# EasyEDA schematic Schematic.json
TITLE: Pocket Play; REV: 1.0; Date: 2025-04-30; Sheet: 1/1; Drawn By: Nico Brooks; Company: Nico Brooks
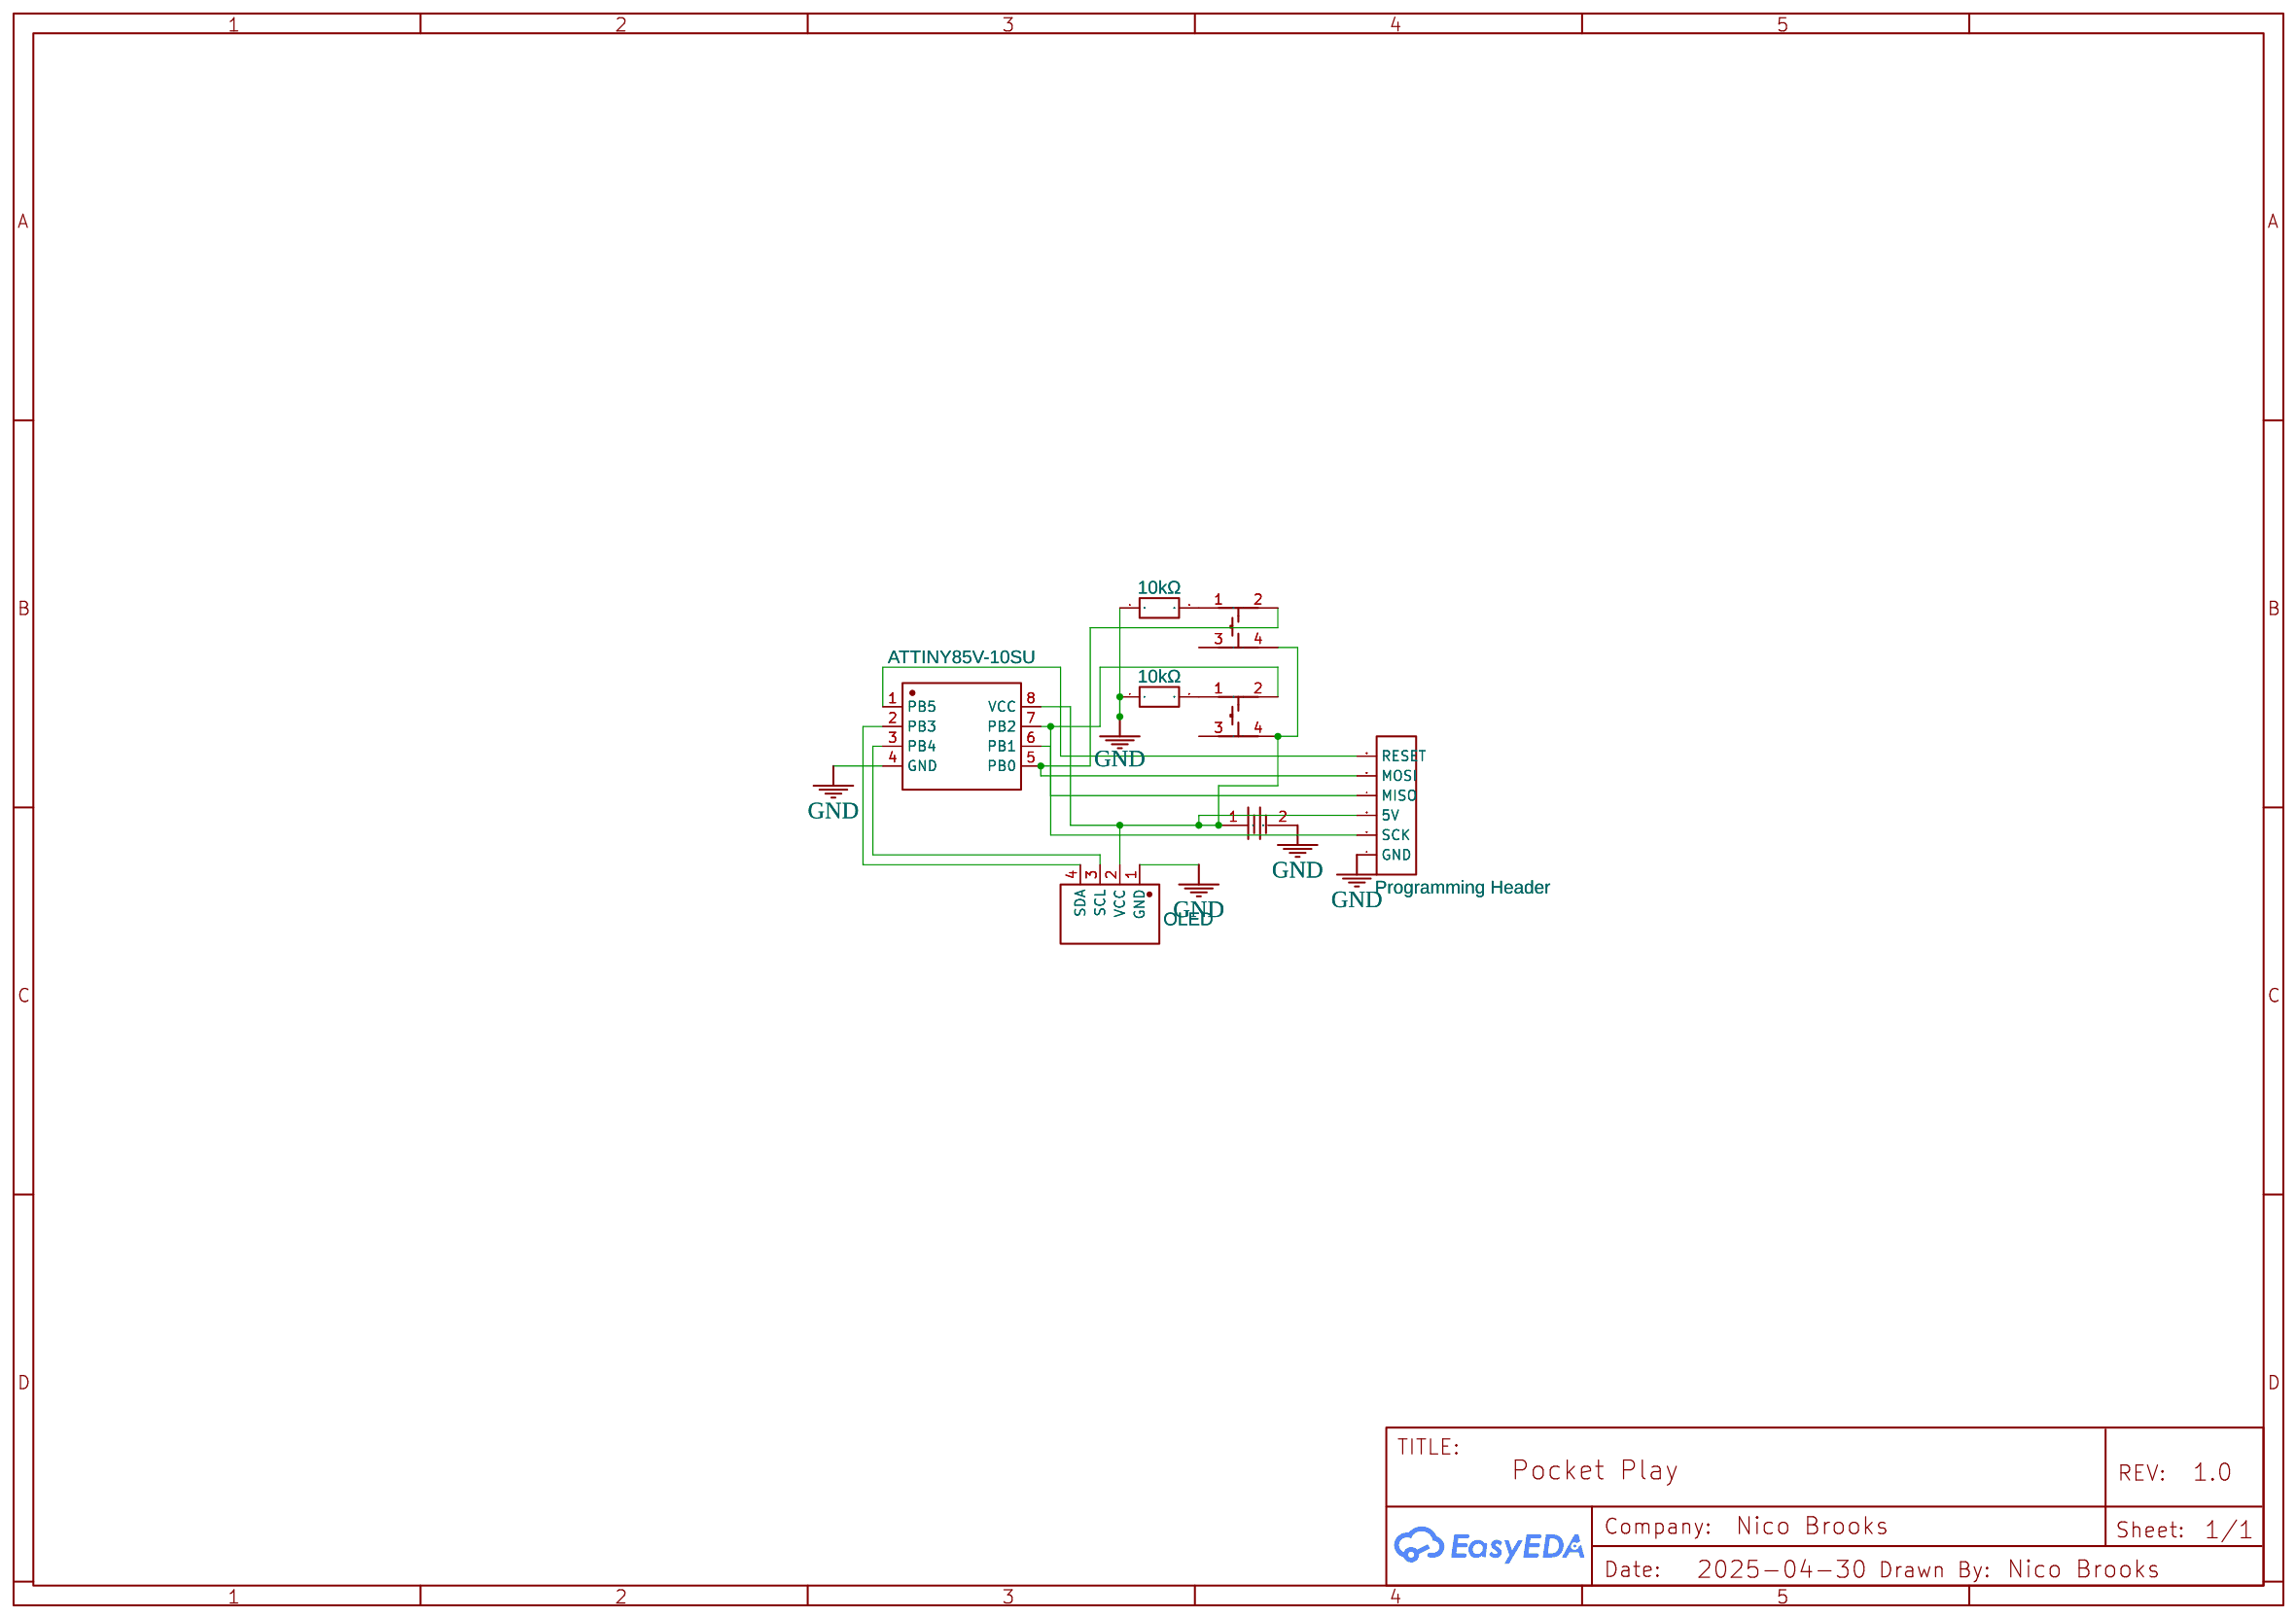
[diagram p0: schematic sheet]

## Parts
B1  CR2032  [BAT-TH_CR2032-BS-6-1]
J1  Programming Header  [HDR-M-2.54_1X6]
OLED1  OLED  [OLED-TH_4P-P2.54-L27.8-W27.3]
U1  10kΩ  [RES-TH_BD2.7-L6.2-P10.20-D0.4]
U2  10kΩ  [RES-TH_BD2.7-L6.2-P10.20-D0.4]
U4  Left Button  [KEY-SMD_4P-L12.0-W12.0-P5.00-LS15.0]
U5  Right Button  [KEY-SMD_4P-L12.0-W12.0-P5.00-LS15.0]
U6  ATTINY85V-10SU  [SOIC-8_L5.3-W5.3-P1.27-LS8.0-BL]

## Library data of the parts
B1 = CR2032-BS-6-1: Supplier: LCSC; Manufacturer: Q&J; Supplier Part: C70377; JLCPCB Part Class: Extended Part
J1 = HEADER_6
OLED1 = UN-2864KMBEG01: Supplier: LCSC; Supplier Part: C9900067968; Manufacturer: null; Contributor: lcsc
U1 U2 = CR1/4W-10K±5%-OT26: Contributor: lcsc; Supplier: LCSC; Supplier Part: C2894537; Manufacturer: VO(翔胜); JLCPCB Part Class: Extended Part
U4 U5 = ZX-QC1212-8.0TP: Supplier: LCSC; Supplier Part: C7470204; Manufacturer: Megastar(兆星); link: https://atta.szlcsc.com/upload/public/pdf/source/20230724/5DFC2D5D4458AD32B5D00135B388D23C.pdf; Contributor: lcsc; JLCPCB Part Class: Extended Part
U6 = ATTINY85V-10SU: Contributor: LCSC; Supplier: LCSC; Supplier Part: C152192; Manufacturer: MICROCHIP(美国微芯); JLCPCB Part Class: Extended Part

## Nets
GND: B1.2 J1.1(GND) OLED1.1(GND) U1.1 U2.1 U6.4(GND)
Net-(B1-1): B1.1 J1.3(5V) OLED1.2(VCC) U4.4 U5.4 U6.8(VCC)
Net-(J1-2): J1.2(SCK) U5.2 U6.7(PB2)
Net-(J1-4): J1.4(MISO) U6.6(PB1)
Net-(J1-5): J1.5(MOSI) U4.2 U6.5(PB0)
Net-(J1-6): J1.6(RESET) U6.1(PB5)
Net-(OLED1-3): OLED1.3(SCL) U6.3(PB4)
Net-(OLED1-4): OLED1.4(SDA) U6.2(PB3)
Net-(U1-2): U1.2 U4.1
Net-(U2-2): U2.2 U5.1

Not connected (* = marked no-connect by the designer): U4 3; U5 3
